# Altium schematic sheet DDS_Modul_Supply_AD9910.SchDoc
size 558 x 431 mm; SheetNumber: 3; SheetTotal: 9
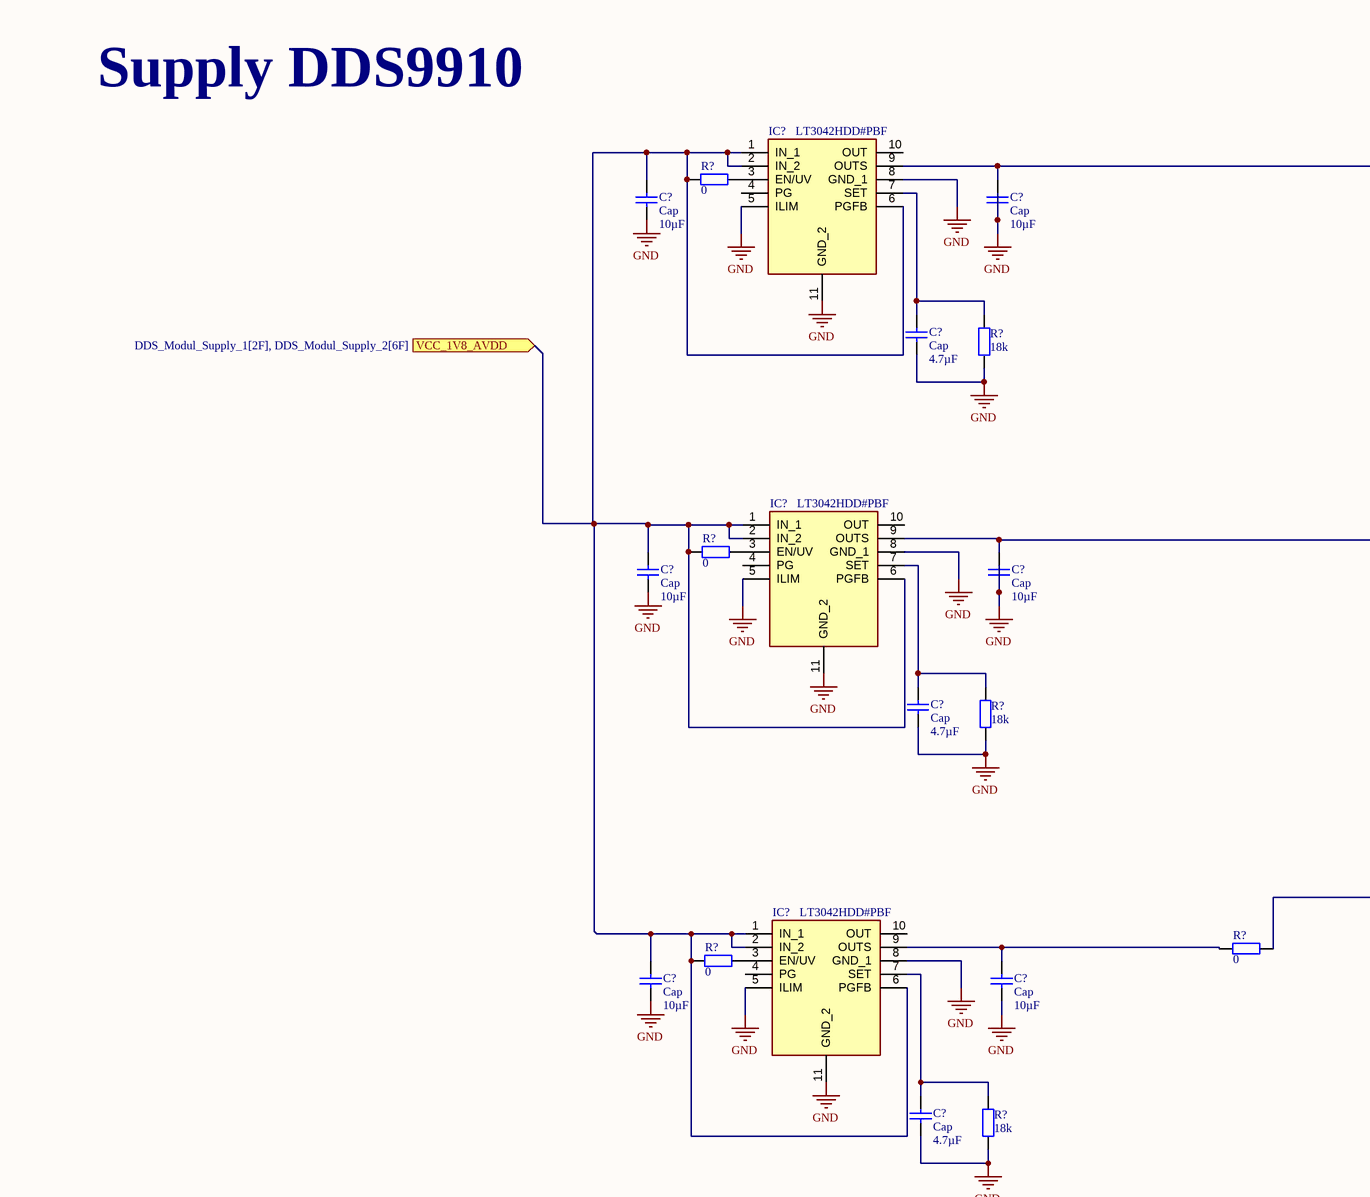
[diagram p0: DDS_Modul_Supply_AD9910.SchDoc, top left]
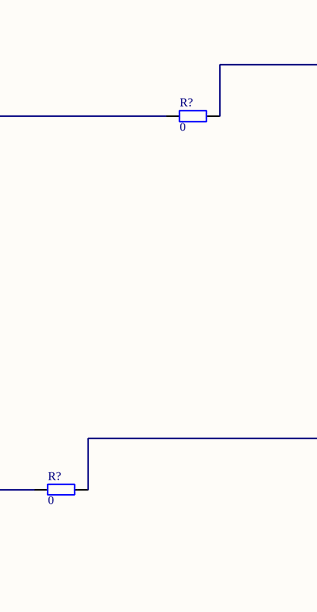
[diagram p1: DDS_Modul_Supply_AD9910.SchDoc, top right]
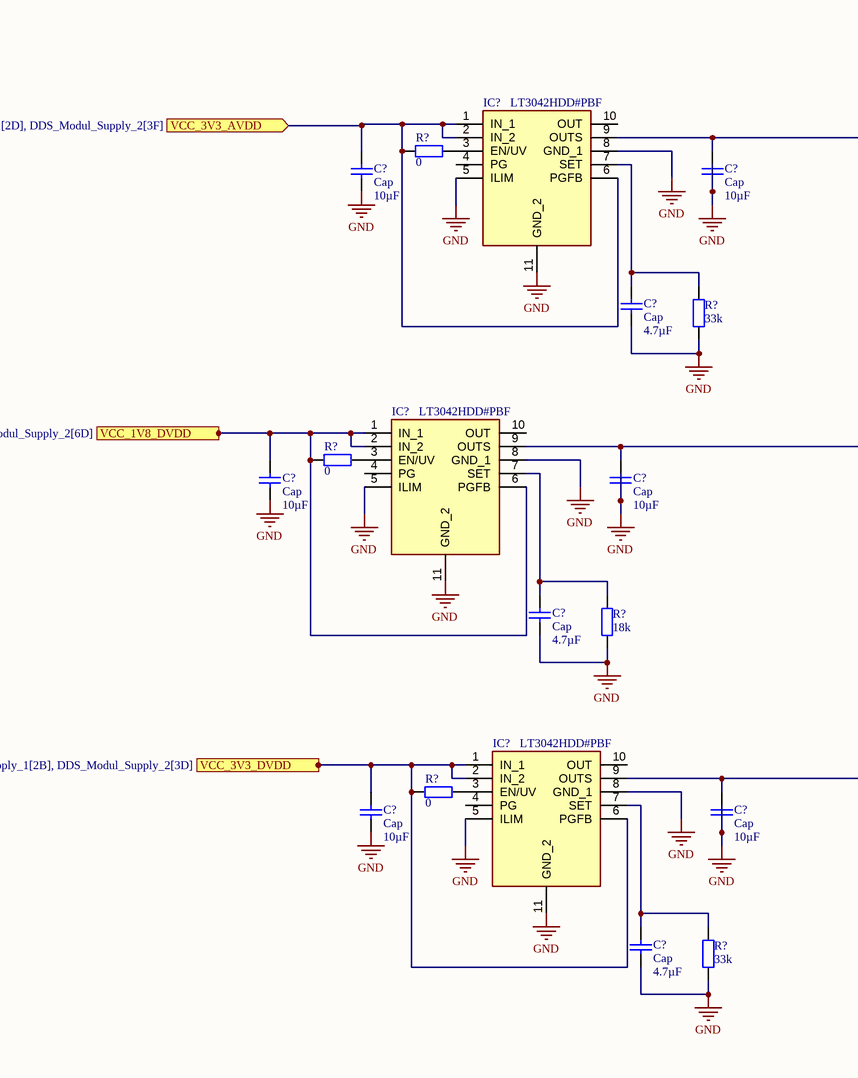
[diagram p2: DDS_Modul_Supply_AD9910.SchDoc, bottom left]
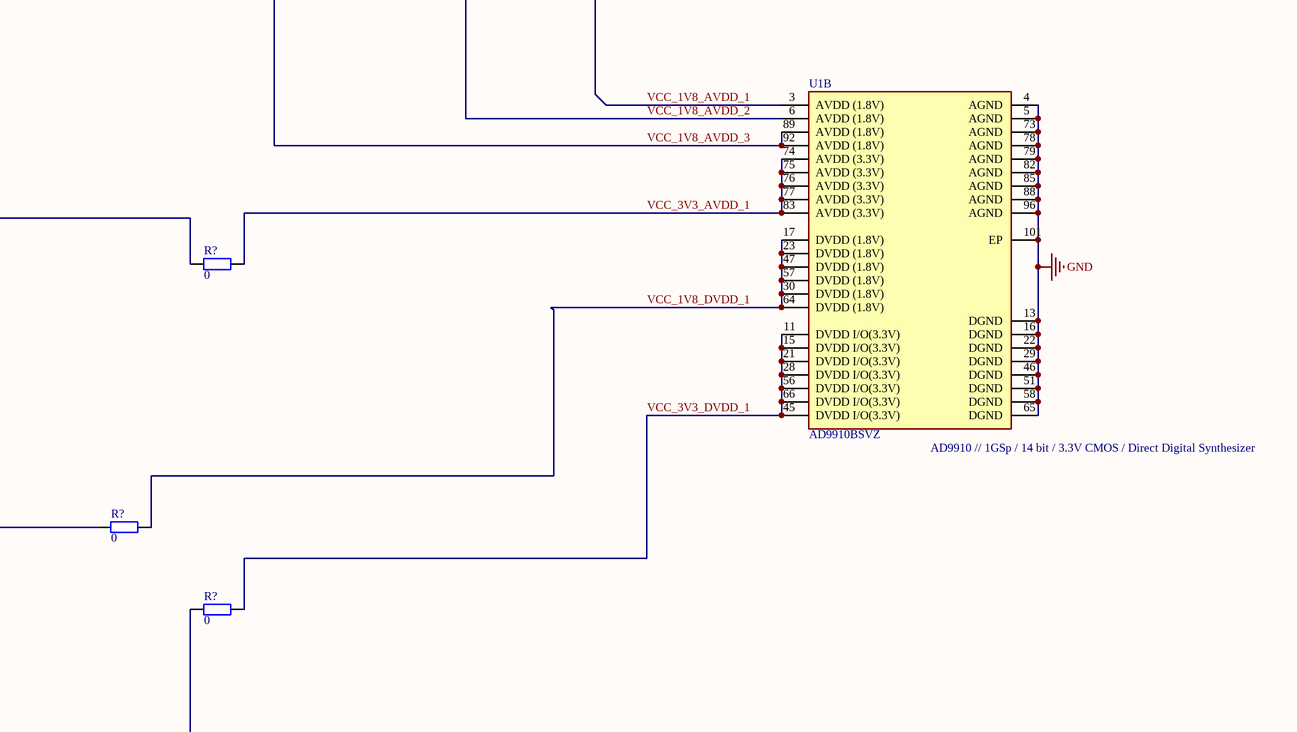
[diagram p3: DDS_Modul_Supply_AD9910.SchDoc, bottom right]

## Parts
(Parts that share a designator on the sheet are numbered #1, #2 ... from top to bottom, then left to right.)
C?#1  Cap  value 10µF  [RAD-0.3]
C?#2  Cap  value 10µF  [RAD-0.3]
C?#3  Cap  value 4.7µF  [RAD-0.3]
C?#4  Cap  value 10µF  [RAD-0.3]
C?#5  Cap  value 10µF  [RAD-0.3]
C?#6  Cap  value 4.7µF  [RAD-0.3]
C?#7  Cap  value 10µF  [RAD-0.3]
C?#8  Cap  value 10µF  [RAD-0.3]
C?#9  Cap  value 4.7µF  [RAD-0.3]
C?#10  Cap  value 10µF  [RAD-0.3]
C?#11  Cap  value 10µF  [RAD-0.3]
C?#12  Cap  value 4.7µF  [RAD-0.3]
C?#13  Cap  value 10µF  [RAD-0.3]
C?#14  Cap  value 10µF  [RAD-0.3]
C?#15  Cap  value 4.7µF  [RAD-0.3]
C?#16  Cap  value 10µF  [RAD-0.3]
C?#17  Cap  value 10µF  [RAD-0.3]
C?#18  Cap  value 4.7µF  [RAD-0.3]
IC?#1  LT3042HDD#PBF  [SON50P300X300X80-11N-D]
IC?#2  LT3042HDD#PBF  [SON50P300X300X80-11N-D]
IC?#3  LT3042HDD#PBF  [SON50P300X300X80-11N-D]
IC?#4  LT3042HDD#PBF  [SON50P300X300X80-11N-D]
IC?#5  LT3042HDD#PBF  [SON50P300X300X80-11N-D]
IC?#6  LT3042HDD#PBF  [SON50P300X300X80-11N-D]
R?#1  value 0  [AXIAL-0.4]
R?#2  value 0  [AXIAL-0.4]
R?#3  value 18k  [AXIAL-0.4]
R?#4  value 0  [AXIAL-0.4]
R?#5  value 0  [AXIAL-0.4]
R?#6  value 18k  [AXIAL-0.4]
R?#7  value 0  [AXIAL-0.4]
R?#8  value 0  [AXIAL-0.4]
R?#9  value 18k  [AXIAL-0.4]
R?#10  value 0  [AXIAL-0.4]
R?#11  value 0  [AXIAL-0.4]
R?#12  value 33k  [AXIAL-0.4]
R?#13  value 0  [AXIAL-0.4]
R?#14  value 0  [AXIAL-0.4]
R?#15  value 0  [AXIAL-0.4]
R?#16  value 18k  [AXIAL-0.4]
R?#17  value 0  [AXIAL-0.4]
R?#18  value 33k  [AXIAL-0.4]
U1  AD9910BSVZ  [FP-SV-100-4-IPC_A]  (part B of 2)

## Ports
VCC_1V8_AVDD (in, see DDS_Modul_Supply_1[2F], DDS_Modul_Supply_2[6F]), VCC_1V8_DVDD (in, see DDS_Modul_Supply_1[2E], DDS_Modul_Supply_2[6D]), VCC_3V3_AVDD (in, see DDS_Modul_Supply_1[2D], DDS_Modul_Supply_2[3F]), VCC_3V3_DVDD (in, see DDS_Modul_Supply_1[2B], DDS_Modul_Supply_2[3D])

## Nets
GND: C?#1.1 C?#2.1 C?#3.1 C?#4.1 C?#5.1 C?#6.1 C?#7.1 C?#8.1 C?#9.1 C?#10.1 C?#11.1 C?#12.1 C?#13.1 C?#14.1 C?#15.1 C?#16.1 C?#17.1 C?#18.1 IC?#1.5(ILIM) IC?#1.8(GND_1) IC?#1.11(GND_2) IC?#2.5(ILIM) IC?#2.8(GND_1) IC?#2.11(GND_2) IC?#3.5(ILIM) IC?#3.8(GND_1) IC?#3.11(GND_2) IC?#4.5(ILIM) IC?#4.8(GND_1) IC?#4.11(GND_2) IC?#5.5(ILIM) IC?#5.8(GND_1) IC?#5.11(GND_2) IC?#6.5(ILIM) IC?#6.8(GND_1) IC?#6.11(GND_2) R?#3.1 R?#6.1 R?#9.1 R?#12.1 R?#16.1 R?#18.1 U1.4(AGND) U1.5(AGND) U1.13(DGND) U1.16(DGND) U1.22(DGND) U1.29(DGND) U1.46(DGND) U1.51(DGND) U1.58(DGND) U1.65(DGND) U1.73(AGND) U1.78(AGND) U1.79(AGND) U1.82(AGND) U1.85(AGND) U1.88(AGND) U1.96(AGND) U1.101(EP)
VCC_1V8_AVDD: C?#1.2 C?#4.2 C?#7.2 IC?#1.1(IN_1) IC?#1.2(IN_2) IC?#1.6(PGFB) IC?#2.1(IN_1) IC?#2.2(IN_2) IC?#2.6(PGFB) IC?#3.1(IN_1) IC?#3.2(IN_2) IC?#3.6(PGFB) R?#2.1 R?#5.1 R?#8.1 ; port VCC_1V8_AVDD
VCC_1V8_AVDD_1: R?#1.2 U1.3(AVDD_(1.8V))
VCC_1V8_AVDD_2: R?#4.2 U1.6(AVDD_(1.8V))
VCC_1V8_AVDD_3: R?#7.2 U1.89(AVDD_(1.8V)) U1.92(AVDD_(1.8V))
VCC_1V8_DVDD: C?#13.2 IC?#5.1(IN_1) IC?#5.2(IN_2) IC?#5.6(PGFB) R?#14.1 ; port VCC_1V8_DVDD
VCC_1V8_DVDD_1: R?#13.2 U1.17(DVDD_(1.8V)) U1.23(DVDD_(1.8V)) U1.30(DVDD_(1.8V)) U1.47(DVDD_(1.8V)) U1.57(DVDD_(1.8V)) U1.64(DVDD_(1.8V))
VCC_3V3_AVDD: C?#10.2 IC?#4.1(IN_1) IC?#4.2(IN_2) IC?#4.6(PGFB) R?#10.1 ; port VCC_3V3_AVDD
VCC_3V3_AVDD_1: R?#11.2 U1.74(AVDD_(3.3V)) U1.75(AVDD_(3.3V)) U1.76(AVDD_(3.3V)) U1.77(AVDD_(3.3V)) U1.83(AVDD_(3.3V))
VCC_3V3_DVDD: C?#16.2 IC?#6.1(IN_1) IC?#6.2(IN_2) IC?#6.6(PGFB) R?#17.1 ; port VCC_3V3_DVDD
VCC_3V3_DVDD_1: R?#15.2 U1.11(DVDD_I/O(3.3V)) U1.15(DVDD_I/O(3.3V)) U1.21(DVDD_I/O(3.3V)) U1.28(DVDD_I/O(3.3V)) U1.45(DVDD_I/O(3.3V)) U1.56(DVDD_I/O(3.3V)) U1.66(DVDD_I/O(3.3V))
NetC?#2_2: C?#2.2 IC?#1.9(OUTS) R?#1.1
NetC?#3_2: C?#3.2 IC?#1.7(SET) R?#3.2
NetC?#5_2: C?#5.2 IC?#2.9(OUTS) R?#4.1
NetC?#6_2: C?#6.2 IC?#2.7(SET) R?#6.2
NetC?#8_2: C?#8.2 IC?#3.9(OUTS) R?#7.1
NetC?#9_2: C?#9.2 IC?#3.7(SET) R?#9.2
NetC?#11_2: C?#11.2 IC?#4.9(OUTS) R?#11.1
NetC?#12_2: C?#12.2 IC?#4.7(SET) R?#12.2
NetC?#14_2: C?#14.2 IC?#5.9(OUTS) R?#13.1
NetC?#15_2: C?#15.2 IC?#5.7(SET) R?#16.2
NetC?#17_2: C?#17.2 IC?#6.9(OUTS) R?#15.1
NetC?#18_2: C?#18.2 IC?#6.7(SET) R?#18.2
NetIC?#1_3: IC?#1.3(EN/UV) R?#2.2
NetIC?#2_3: IC?#2.3(EN/UV) R?#5.2
NetIC?#3_3: IC?#3.3(EN/UV) R?#8.2
NetIC?#4_3: IC?#4.3(EN/UV) R?#10.2
NetIC?#5_3: IC?#5.3(EN/UV) R?#14.2
NetIC?#6_3: IC?#6.3(EN/UV) R?#17.2

Not connected (* = marked no-connect by the designer): IC?#1 4(PG) 10(OUT); IC?#2 4(PG) 10(OUT); IC?#3 4(PG) 10(OUT); IC?#4 4(PG) 10(OUT); IC?#5 4(PG) 10(OUT); IC?#6 4(PG) 10(OUT)

## Notes on the sheet
- Supply DDS9910
- (near U1) AD9910 // 1GSp / 14 bit / 3.3V CMOS / Direct Digital Synthesizer
- DWG. NO.
- REV.
- SHT.
- REVISION
- DESCRIPTION
- DATE
- APPROVED
- THIS DOCUMENT AND THE DATA DISCLOSED HEREIN OR HEREWITH IS THE PROPERTY OF ALTIUM LIMITED AND MAY BE FREELY DISTRIBUTED IN WHOLE. NO RIGHTS ARE RESERVED OR EXPRESS OR IMPLIED WARANTEE GIVEN.
- ENG:
- DSN:
- APPROVALS
- PROJECT
- DOCUMENT REVISION:
- DESIGN ITEM:
- CHK:
- BOM:
- REFERENCE DOCUMENTS
- PROJECT REVISION:
- TITLE
- FAB DWG:
- PCB DWG:
- ASSY DWG:
- SCALE:
- SIZE
- C
- CAGE CODE
- FILE NAME
- DWG NO.
- SHEET
- OF
- REV

## Library data of the parts
C?#1-C?#18 = Cap: Capacitor; Published: 8-Jun-2000; LatestRevisionDate: 17-Jul-2002; LatestRevisionNote: Re-released for DXP Platform.; PackageReference: RAD-0.3; Publisher: Altium Limited; PackageDescription: Radial Cap, Thru-Hole; 2 Leads; 0.3 in Pin Spacing
IC?#1-IC?#6 = LT3042HDD#PBF: Integrated Circuit; Manufacturer_Name: Analog Devices; Datasheet Link: https://datasheet.datasheetarchive.com/originals/distributors/DKDS-14/269629.pdf; Height: 0.8mm; Manufacturer_Part_Number: LT3042HDD#PBF; Mouser Part Number: 584-LT3042HDD#PBF; Mouser Price/Stock: https://www.mouser.co.uk/ProductDetail/Analog-Devices-Linear-Technology/LT3042HDDPBF?qs=oahfZPh6IAKXR%252BCYz0F0Vw%3D%3D; Arrow Part Number: LT3042HDD#PBF; Arrow Price/Stock: https://www.arrow.com/en/products/lt3042hddpbf/analog-devices?region=nac
R?#1-R?#18 = Res2: Resistor; Published: 8-Jun-2000; LatestRevisionDate: 17-Jul-2002; LatestRevisionNote: Re-released for DXP Platform.; PackageReference: AXIAL-0.4; Publisher: Altium Limited; PackageDescription: Axial Device, Thru-Hole; 2 Leads; 0.4 in Pin Spacing
U1 = CMP-0293-00026-2: IC DDS 1GHZ 14BIT 100TQFP; Max Supply Voltage: 1.89V; Operating Supply Voltage: 1.8V; Max Supply Current: 110mA; Number of Outputs: 1; Conversion Rate: 1000000KS/s; Resolution: 14b; Nominal Supply Current: 29mA; Min Supply Voltage: 1.71V; Mount: Surface Mount; Case/Package: TQFP; Number of Pins: 100; Frequency: 1GHz; Width: 14mm; Length: 14mm; Contact Plating: Tin; RoHS Compliant: Yes; Number of Converters: 1; Height: 1mm; Packaging: Tray; REACH SVHC: No SVHC; Max Operating Temperature: 85°C; Number of D/A Converters: 1; Lead Free: Contains Lead; Package Quantity: 90; Min Operating Temperature: -40°C